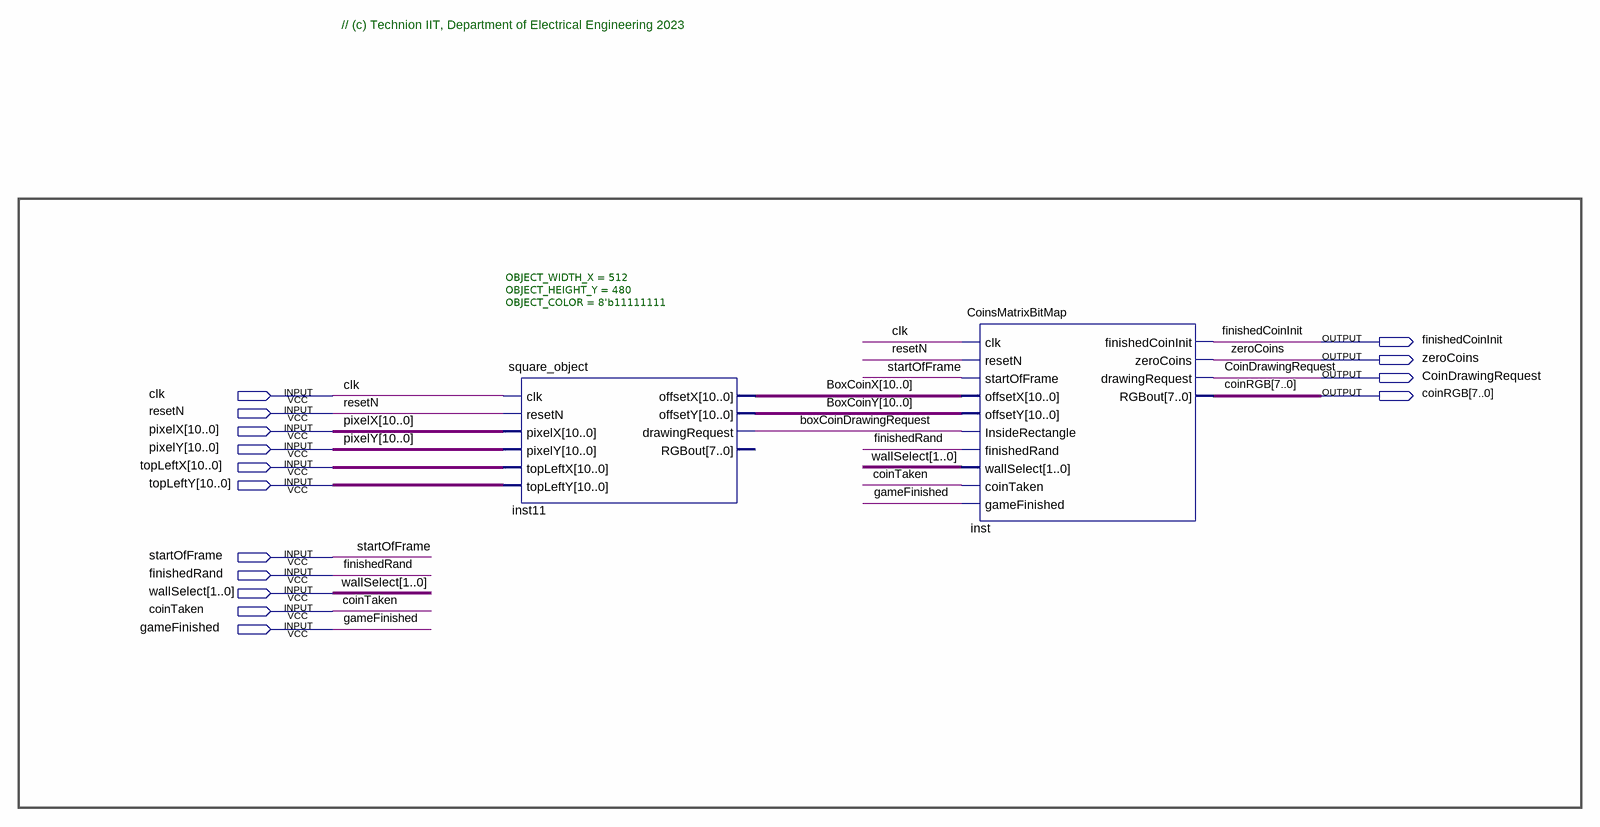
[diagram p0: schematic sheet]
// Quartus schematic COINS_DISPLAY.bdf as structural Verilog: 2 symbols, 15 pins
module COINS_DISPLAY (
  input  clk,
  input  resetN,
  input  [10:0] pixelX,
  input  [10:0] pixelY,
  input  [10:0] topLeftX,
  input  [10:0] topLeftY,
  input  startOfFrame,
  input  finishedRand,
  input  [1:0] wallSelect,
  input  coinTaken,
  input  gameFinished,
  output finishedCoinInit,
  output zeroCoins,
  output CoinDrawingRequest,
  output [7:0] coinRGB
);

  wire boxCoinDrawingRequest;
  wire [10:0] BoxCoinX, BoxCoinY;

  square_object #(.OBJECT_WIDTH_X(512), .OBJECT_HEIGHT_Y(480), .OBJECT_COLOR(8'b11111111)) inst11 (
    .clk(clk), .resetN(resetN), .pixelX(pixelX), .pixelY(pixelY), .topLeftX(topLeftX), .topLeftY(topLeftY),
    .offsetX(BoxCoinX), .offsetY(BoxCoinY), .drawingRequest(boxCoinDrawingRequest));  // open: RGBout
  CoinsMatrixBitMap inst (
    .clk(clk), .resetN(resetN), .startOfFrame(startOfFrame), .offsetX(BoxCoinX), .offsetY(BoxCoinY),
    .InsideRectangle(boxCoinDrawingRequest), .finishedRand(finishedRand), .wallSelect(wallSelect),
    .coinTaken(coinTaken), .gameFinished(gameFinished), .finishedCoinInit(finishedCoinInit),
    .zeroCoins(zeroCoins), .drawingRequest(CoinDrawingRequest), .RGBout(coinRGB));

  // Notes on the sheet:
  //   // (c) Technion IIT, Department of Electrical Engineering 2023
endmodule
